# EAGLE design 5v-to220 (EAGLE 7.7.0)
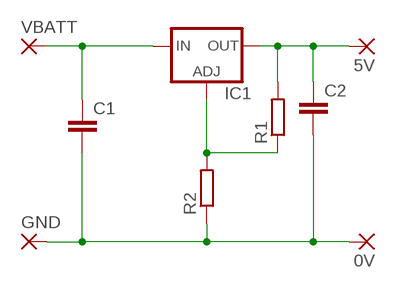
[diagram p0: schematic, sheet 1]

## Parts
0V  WIREPAD4,16O1,6  [4,16O1,6]
5V  WIREPAD4,16O1,6  [4,16O1,6]
C1  C-EU050-024X044  [C050-024X044]
C2  C-EU050-024X044  [C050-024X044]
GND  WIREPAD4,16O1,6  [4,16O1,6]
IC1  LM138-TL  [TO220L1]
R1  R-EU_0207/10  [0207/10]
R2  R-EU_0207/10  [0207/10]
VBATT  WIREPAD4,16O1,6  [4,16O1,6]

## Nets
5V: 5V.1(P) C2.1 IC1.2(OUT) R1.2
ADJ: IC1.1(ADJ) R1.1 R2.2
GND: 0V.1(P) C1.2 C2.2 GND.1(P) R2.1
VBATT: C1.1 IC1.3(IN) VBATT.1(P)

## Library data of the parts
0V 5V GND VBATT = wirepad:WIREPAD: Wire PAD connect wire on PCB
C1 C2 = resistor:C-EU: CAPACITOR, European symbol
IC1 = v-reg:LM138-TL: VOLTAGE REGULATOR
R1 R2 = resistor:R-EU_: RESISTOR, European symbol

## Board
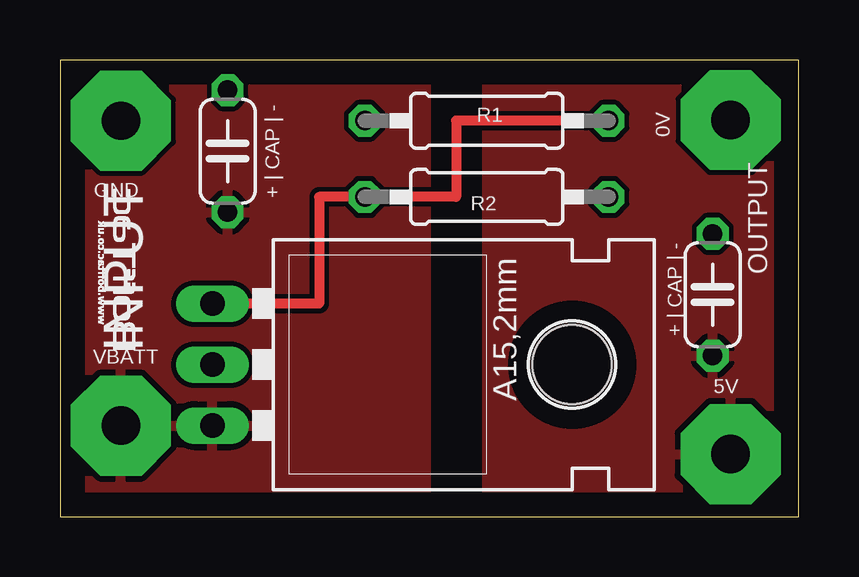
[diagram p1: board, top side]
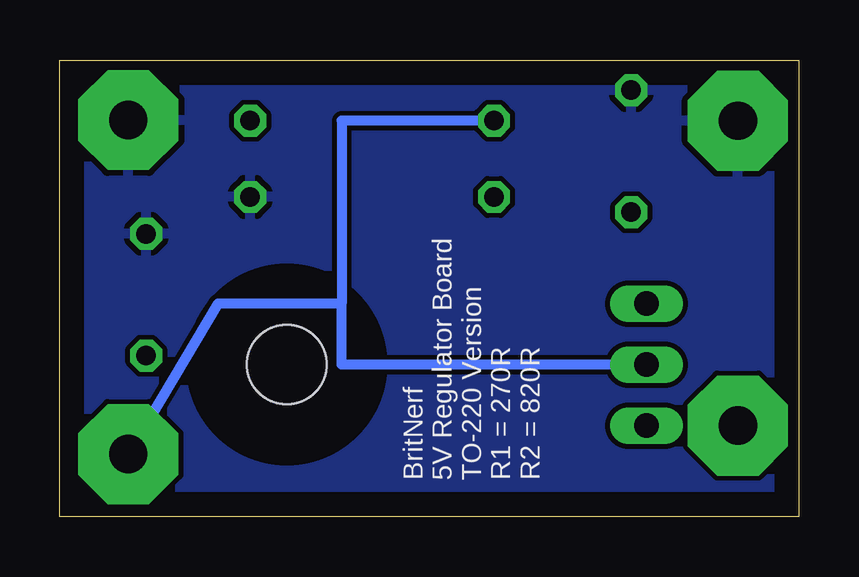
[diagram p2: board, bottom side, seen from below]

Size 30.79 x 19.04 mm. Coordinates in mm from the lower left corner, seen from the top.
Outline: 0,0 30.79,0 30.79,19.04 0,19.04 0,0
Copper layers (1*16): Top 0.035mm / dielectric 1.5mm / Bottom 0.035mm
Design rules "default": minimum track width 10mil, minimum drill 24mil, track to track 8mil, track to pad 8mil, pad to pad 8mil, via to via 8mil, smd to smd 8mil, copper to edge 40mil, drill to drill 8mil, minimum pad ring 10mil, minimum via ring 8mil, stop-mask expansion 4mil, vias tented up to drill 0mil, thermal gap 10mil

### Footprints (pad centres in the part's own frame; a part is rotated, then mirrored left to right if it is on the bottom)
4,16O1,6 = drill 1.6 pad 4.166 octagon: 1 0,0
C050-024X044 = drill 0.813 octagon: 1 -2.54,0; 2 2.54,0
TO220L1 = drill 1.016 long: 1 -2.54,-3.81; 2 0,-3.81; 3 2.54,-3.81 | hole 3.302: 0,11.176
0207/10 = drill 0.813 octagon: 1 -5.08,0; 2 5.08,0

### Placement (x,y rotation side)
0V  27.94,16.54 0 top
5V  27.94,2.62 0 top
C1  6.99,15.24 90 top
C2  27.2,9.26 90 top
GND  2.54,16.51 0 top
IC1  10.16,6.35 270 top
R1  17.78,16.51 180 top
R2  17.78,13.34 180 top
VBATT  2.54,3.81 0 top

### Tracks (layer width: path | path; a pad name or v marks a point on that pad's centre or on a via)
5V
  Bottom 0.406: IC1.2 19.05,6.35 19.05,8.89 | 19.05,8.89 24.21,8.89 5V.1 | R1.2 19.05,16.51 19.05,8.89
  pour Top: 17.78,19.05 17.78,0 33.02,0 33.02,19.05
ADJ
  Top 0.406: R1.1 16.51,16.51 16.51,13.34 R2.2 10.79,13.34 10.79,8.89 IC1.1
GND
  pour Bottom: 0,19.05 33.02,19.05 33.02,0 0,0
VBATT
  pour Top: 0,19.05 15.24,19.05 15.24,0 0,0

### Text on the board
tNames: + | CAP | - | OUTPUT | INPUT | + | CAP | -
bNames: BritNerf / 5V Regulator Board / TO-220 Version / R1 = 270R / R2 = 820R | Y:/BoffTac/Logo/monologo-w-address.bmp